# EAGLE design main (EAGLE 5.11)
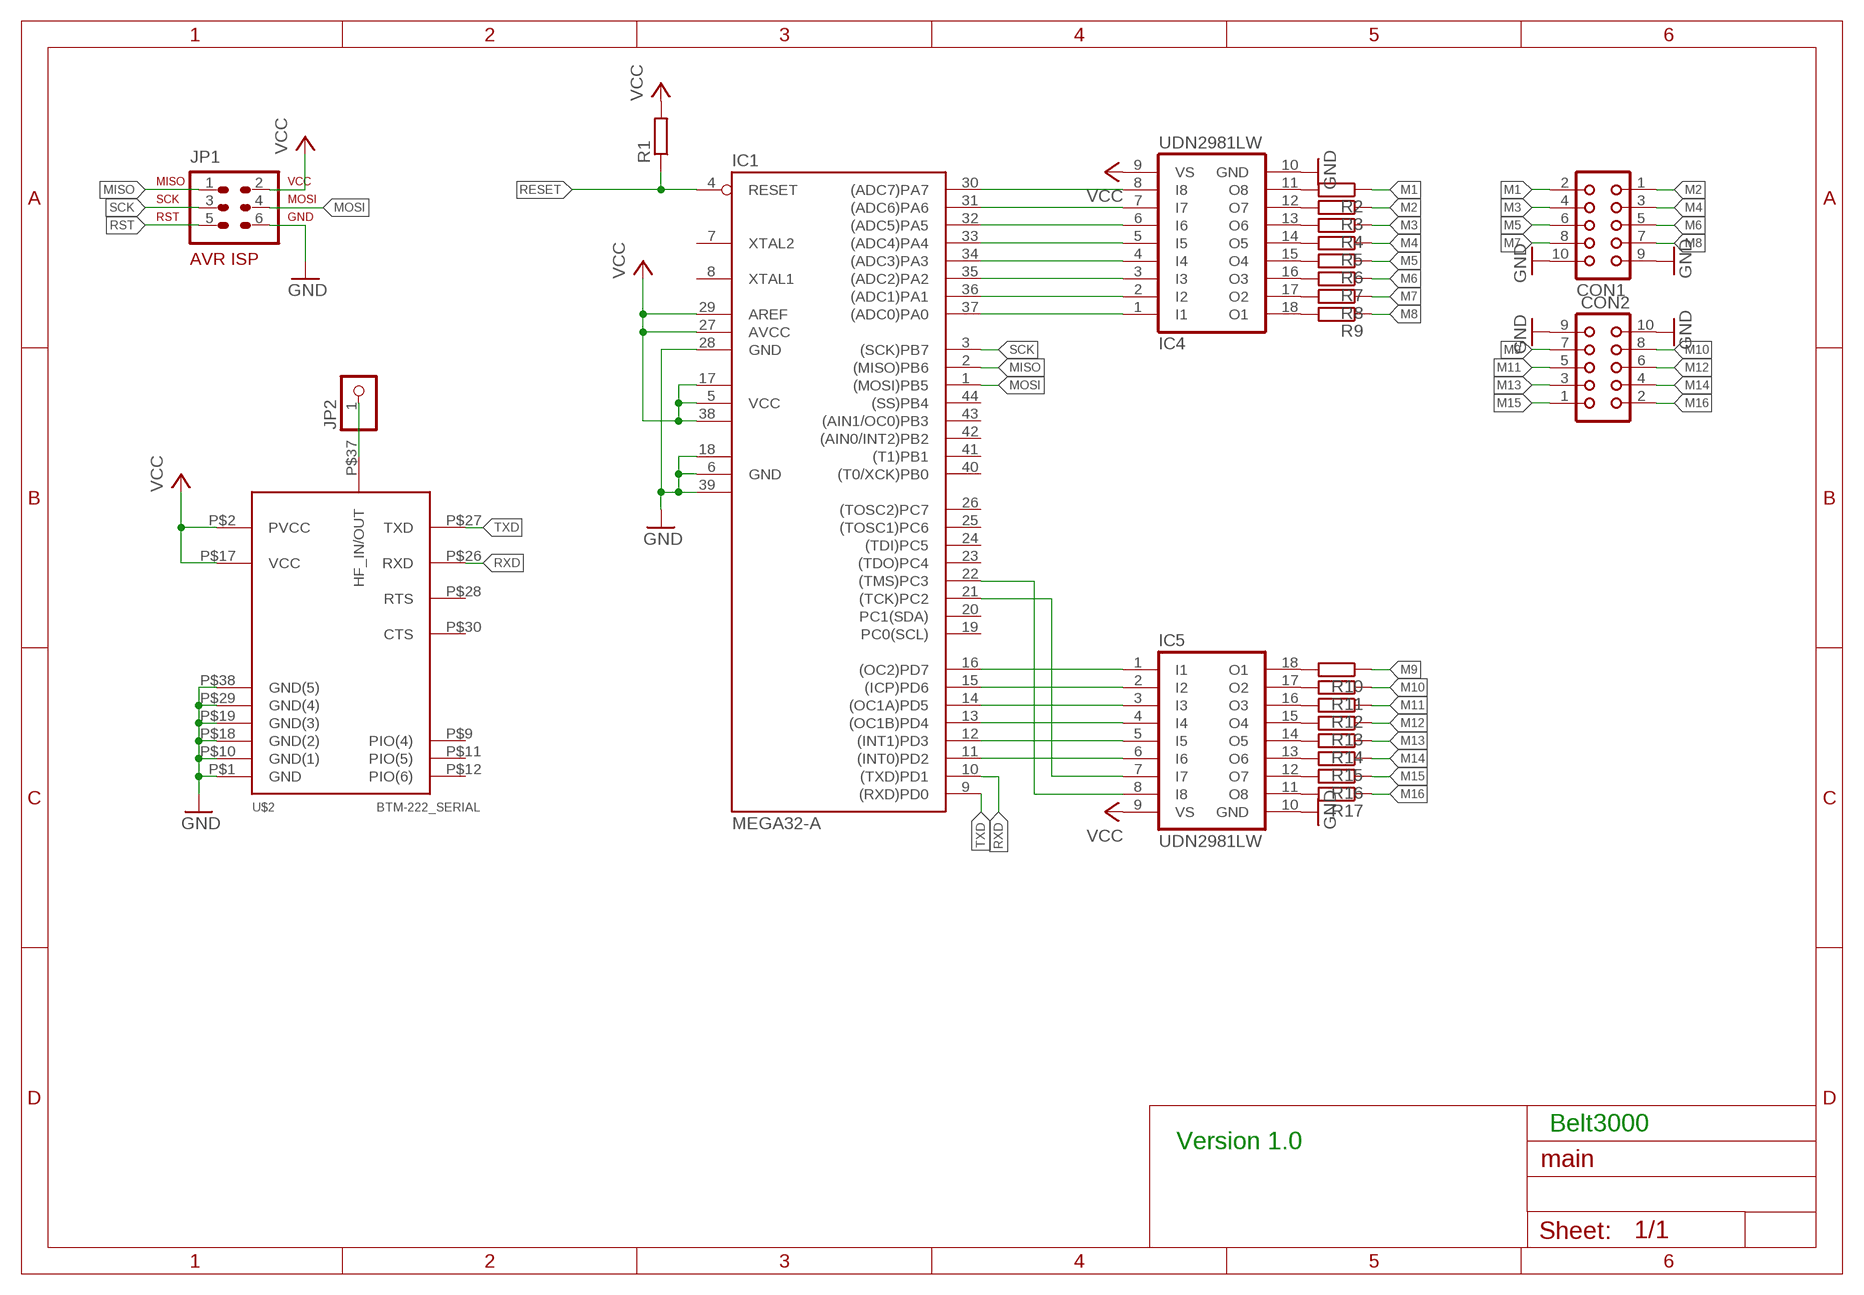
[diagram p0: schematic, sheet 1]

## Parts
CON1  CON10  [CON10]
CON2  CON10  [CON10]
IC1  MEGA32-A  [TQFP44]
IC4  UDN2981LW  [SO18W]
IC5  UDN2981LW  [SO18W]
JP1  AVR-ISP-6VERT  [AVR-ISP-6]
JP2  PINHD-1X1  [1X01]
R1  R-EU_R1206W  [R1206W]
R2  R-EU_R1206W  [R1206W]
R3  R-EU_R1206W  [R1206W]
R4  R-EU_R1206W  [R1206W]
R5  R-EU_R1206W  [R1206W]
R6  R-EU_R1206W  [R1206W]
R7  R-EU_R1206W  [R1206W]
R8  R-EU_R1206W  [R1206W]
R9  R-EU_R1206W  [R1206W]
R10  R-EU_R1206W  [R1206W]
R11  R-EU_R1206W  [R1206W]
R12  R-EU_R1206W  [R1206W]
R13  R-EU_R1206W  [R1206W]
R14  R-EU_R1206W  [R1206W]
R15  R-EU_R1206W  [R1206W]
R16  R-EU_R1206W  [R1206W]
R17  R-EU_R1206W  [R1206W]
U$2  BTM-222_SERIAL  [BTM-222]

## Nets
GND: CON1.9 CON1.10 CON2.9 CON2.10 IC1.6(GND) IC1.18(GND1) IC1.28(GND) IC1.39(GND2) IC4.10(GND) IC5.10(GND) JP1.6 U$2.P$1(GND) U$2.P$10(GND(1)) U$2.P$18(GND(2)) U$2.P$19(GND(3)) U$2.P$29(GND(4)) U$2.P$38(GND(5))
M1: CON1.2 R2.1
M2: CON1.1 R3.1
M3: CON1.4 R4.1
M4: CON1.3 R5.1
M5: CON1.6 R6.1
M6: CON1.5 R7.1
M7: CON1.8 R8.1
M8: CON1.7 R9.1
M9: CON2.7 R10.1
M10: CON2.8 R11.1
M11: CON2.5 R12.1
M12: CON2.6 R13.1
M13: CON2.3 R14.1
M14: CON2.4 R15.1
M15: CON2.1 R16.1
M16: CON2.2 R17.1
MISO: IC1.2((MISO)PB6) JP1.1
MOSI: IC1.1((MOSI)PB5) JP1.4
N$1: IC1.37((ADC0)PA0) IC4.1(I1)
N$2: IC1.36((ADC1)PA1) IC4.2(I2)
N$3: IC1.35((ADC2)PA2) IC4.3(I3)
N$4: IC1.34((ADC3)PA3) IC4.4(I4)
N$5: IC1.33((ADC4)PA4) IC4.5(I5)
N$6: IC1.32((ADC5)PA5) IC4.6(I6)
N$7: IC1.31((ADC6)PA6) IC4.7(I7)
N$8: IC1.30((ADC7)PA7) IC4.8(I8)
N$9: IC1.16((OC2)PD7) IC5.1(I1)
N$10: IC1.15((ICP)PD6) IC5.2(I2)
N$11: IC1.14((OC1A)PD5) IC5.3(I3)
N$12: IC1.13((OC1B)PD4) IC5.4(I4)
N$13: IC1.12((INT1)PD3) IC5.5(I5)
N$14: IC1.11((INT0)PD2) IC5.6(I6)
N$15: IC1.22((TMS)PC3) IC5.8(I8)
N$16: IC1.21((TCK)PC2) IC5.7(I7)
N$17: JP2.1 U$2.P$37(HF_IN/OUT)
N$18: IC4.11(O8) R2.2
N$19: IC4.12(O7) R3.2
N$20: IC4.13(O6) R4.2
N$21: IC4.14(O5) R5.2
N$22: IC4.15(O4) R6.2
N$23: IC4.16(O3) R7.2
N$24: IC4.17(O2) R8.2
N$25: IC4.18(O1) R9.2
N$26: IC5.18(O1) R10.2
N$27: IC5.17(O2) R11.2
N$28: IC5.16(O3) R12.2
N$29: IC5.15(O4) R13.2
N$30: IC5.14(O5) R14.2
N$31: IC5.13(O6) R15.2
N$32: IC5.12(O7) R16.2
N$33: IC5.11(O8) R17.2
RESET: IC1.4(RESET) R1.1
RST: JP1.5
RXD: IC1.10((TXD)PD1) U$2.P$26(RXD)
SCK: IC1.3((SCK)PB7) JP1.3
TXD: IC1.9((RXD)PD0) U$2.P$27(TXD)
VCC: IC1.5(VCC) IC1.17(VCC1) IC1.27(AVCC) IC1.29(AREF) IC1.38(VCC2) IC4.9(VS) IC5.9(VS) JP1.2 R1.2 U$2.P$2(PVCC) U$2.P$17(VCC)
Unconnected: IC1.7(XTAL2) IC1.8(XTAL1) IC1.19(PC0(SCL)) IC1.20(PC1(SDA)) IC1.23((TDO)PC4) IC1.24((TDI)PC5) IC1.25((TOSC1)PC6) IC1.26((TOSC2)PC7) IC1.40((T0/XCK)PB0) IC1.41((T1)PB1) IC1.42((AIN0/INT2)PB2) IC1.43((AIN1/OC0)PB3) IC1.44((SS)PB4) U$2.P$9(PIO(4)) U$2.P$11(PIO(5)) U$2.P$12(PIO(6)) U$2.P$28(RTS) U$2.P$30(CTS)

## Notes on the sheet
- Belt3000
- Version 1.0

## Library data of the parts
CON1 CON2 = con-harting:CON10: CONNECTOR; OC_FARNELL: unknown; OC_NEWARK: unknown
IC1 = atmel:MEGA32: MICROCONTROLLER 32 Kbytes FLASH 2 Kbytes SRAM 1 Kbytes EEPROM USART 8-channel 10 bit ADC Source: www.atmel.com .. doc2503.pdf; MPN: ATMEGA32-16AU; OC_FARNELL: 9171274; OC_NEWARK: 69K6677
IC4 IC5 = uln-udn2:UDN298*: DRIVER ARRAY Source: Allegro Microsystems Inc. / UDN2981-UDN2984.pdf
JP1 = avr-7:AVR-ISP-6: AVR ISP-6 Serial Programming Header
JP2 = pinhead:PINHD-1X1: PIN HEADER
R1-R17 = rcl:R-EU_: RESISTOR, European symbol
U$2 = BTM_222:BTM-222_SERIAL

## Board
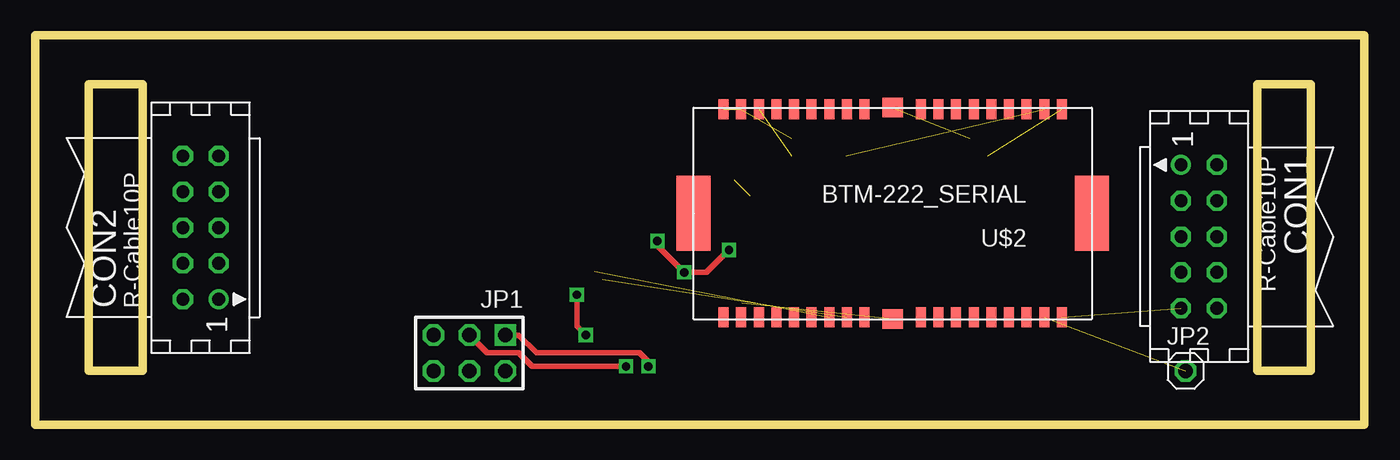
[diagram p1: board, top side]
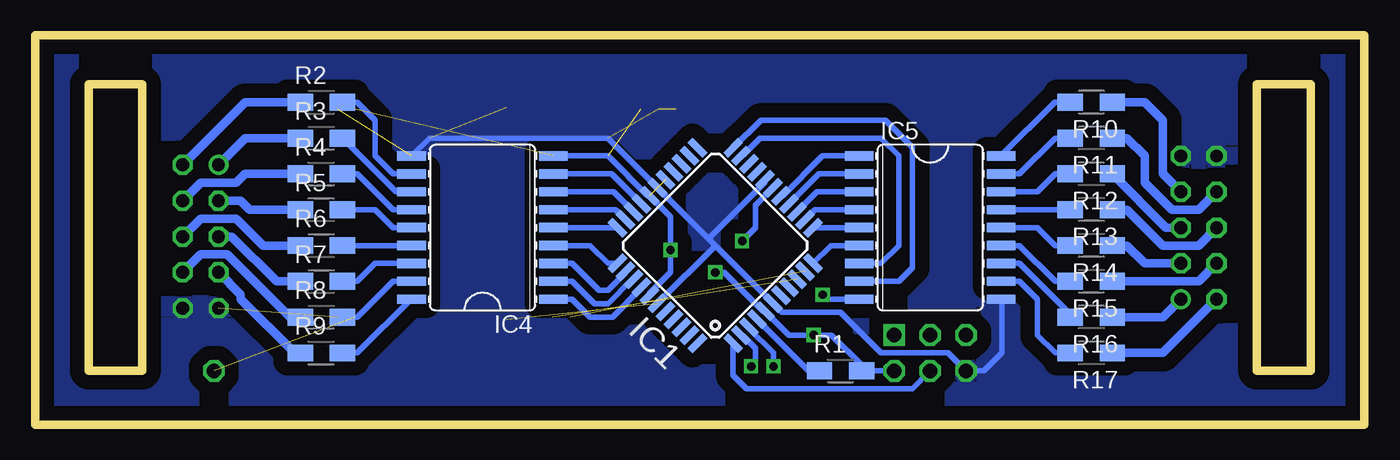
[diagram p2: board, bottom side, seen from below]

Size 94.28 x 27.61 mm. Coordinates in mm from the lower left corner, seen from the top.
Outline: 0,0 94.28,0 94.28,27.61 0,27.61 0,0
Outline: 3.81,24.13 7.62,24.13 7.62,3.81 3.81,3.81 3.81,24.13
Outline: 90.49,24.13 90.49,3.81 86.68,3.81 86.68,24.13 90.49,24.13
Copper layers (1*16): Top 0.035mm / dielectric 1.5mm / Bottom 0.035mm
Design rules "default": minimum track width 10mil, minimum drill 24mil, track to track 8mil, track to pad 8mil, pad to pad 8mil, via to via 8mil, smd to smd 8mil, copper to edge 40mil, drill to drill 8mil, minimum pad ring 10mil, minimum via ring 8mil, stop-mask expansion 4mil, vias tented up to drill 0mil, thermal gap 10mil

### Footprints (pad centres in the part's own frame; a part is rotated, then mirrored left to right if it is on the bottom)
CON10 = drill 0.914 round: 1 -5.08,-1.27 | drill 0.914 octagon: 2 -5.08,1.27; 3 -2.54,-1.27; 4 -2.54,1.27; 5 0,-1.27; 6 0,1.27; 7 2.54,-1.27; 8 2.54,1.27; 9 5.08,-1.27; 10 5.08,1.27
TQFP44 = smd 1.5 x 0.5: 1 -5.8,4; 2 -5.8,3.2; 3 -5.8,2.4; 4 -5.8,1.6; 5 -5.8,0.8; 6 -5.8,0; 7 -5.8,-0.8; 8 -5.8,-1.6; 9 -5.8,-2.4; 10 -5.8,-3.2; 11 -5.8,-4; 23 5.8,-4; 24 5.8,-3.2; 25 5.8,-2.4; 26 5.8,-1.6; 27 5.8,-0.8; 28 5.8,0; 29 5.8,0.8; 30 5.8,1.6; 31 5.8,2.4; 32 5.8,3.2; 33 5.8,4 | smd 0.5 x 1.5: 12 -4,-5.8; 13 -3.2,-5.8; 14 -2.4,-5.8; 15 -1.6,-5.8; 16 -0.8,-5.8; 17 0,-5.8; 18 0.8,-5.8; 19 1.6,-5.8; 20 2.4,-5.8; 21 3.2,-5.8; 22 4,-5.8; 34 4,5.8; 35 3.2,5.8; 36 2.4,5.8; 37 1.6,5.8; 38 0.8,5.8; 39 0,5.8; 40 -0.8,5.8; 41 -1.6,5.8; 42 -2.4,5.8; 43 -3.2,5.8; 44 -4,5.8
SO18W = smd 0.66 x 2.032: 1 -5.08,-5.029; 2 -3.81,-5.029; 3 -2.54,-5.029; 4 -1.27,-5.029; 5 0,-5.029; 6 1.27,-5.029; 7 2.54,-5.029; 8 3.81,-5.029; 9 5.08,-5.029; 10 5.08,5.029; 11 3.81,5.029; 12 2.54,5.029; 13 1.27,5.029; 14 0,5.029; 15 -1.27,5.029; 16 -2.54,5.029; 17 -3.81,5.029; 18 -5.08,5.029
AVR-ISP-6 = drill 1.016 square: 1 -2.54,-1.27 | drill 1.016 octagon: 2 -2.54,1.27; 3 0,-1.27; 4 0,1.27; 5 2.54,-1.27; 6 2.54,1.27
1X01 = drill 1.016 octagon: 1 0,0
R1206W = smd 1.8 x 1.2: 1 -1.499,0; 2 1.499,0
BTM-222 = smd 2.4 x 5.3: $AGND -14.625,3.75; $BGND 13.625,3.75 | smd 0.711 x 1.422: P$1 -12.5,-3.625; P$2 -11.25,-3.625; P$3 -10,-3.625; P$4 -8.75,-3.625; P$5 -7.5,-3.625; P$6 -6.25,-3.625; P$7 -5,-3.625; P$8 -3.75,-3.625; P$9 -2.5,-3.625; P$11 1.5,-3.625; P$12 2.75,-3.625; P$13 4,-3.625; P$14 5.25,-3.625; P$15 6.5,-3.625; P$16 7.75,-3.625; P$17 9,-3.625; P$18 10.25,-3.625; P$19 11.5,-3.625; P$20 11.5,11.125; P$21 10.25,11.125; P$22 9,11.125; P$23 7.75,11.125; P$24 6.5,11.125; P$25 5.25,11.125; P$26 4,11.125; P$27 2.75,11.125; P$28 1.5,11.125; P$30 -2.5,11.125; P$31 -3.75,11.125; P$32 -5,11.125; P$33 -6.25,11.125; P$34 -7.5,11.125; P$35 -8.75,11.125; P$36 -10,11.125; P$37 -11.25,11.125; P$38 -12.5,11.125 | smd 1.422 x 1.4: P$10 -0.5,-3.75; P$29 -0.5,11.25

### Placement (x,y rotation side)
CON1  82.55,13.33 270 top
CON2  11.75,13.97 90 top
IC1  46.04,12.7 135 bottom
IC4  62.55,13.97 90 bottom
IC5  30.8,13.97 270 bottom
JP1  30.8,5.08 180 top
JP2  81.6,3.81 0 top
R1  37.15,3.81 0 bottom
R2  73.98,22.86 0 bottom
R3  73.98,20.32 0 bottom
R4  73.98,17.78 0 bottom
R5  73.98,15.24 0 bottom
R6  73.98,12.7 0 bottom
R7  73.98,10.16 0 bottom
R8  73.98,7.62 0 bottom
R9  73.98,5.08 0 bottom
R10  19.37,22.86 180 bottom
R11  19.37,20.32 180 bottom
R12  19.37,17.78 180 bottom
R13  19.37,15.24 180 bottom
R14  19.37,12.7 180 bottom
R15  19.37,10.16 180 bottom
R16  19.37,7.62 180 bottom
R17  19.37,5.08 180 bottom
U$2  60.33,18.73 180 top

### Tracks (layer width: path | path; a pad name or v marks a point on that pad's centre or on a via)
GND  (6 unrouted)
  Bottom 0.406: IC5.10 25.72,8.84 25.72,5.08 26.99,3.81 JP1.6 29.53,5.08 34.29,5.08 37.17,7.96 41.3,7.96 IC1.6 46.04,12.7 | IC1.28 | IC1.28 53.66,20.32 66.31,20.32 IC4.10 | 46.04,12.7 46.51,13.18 | 46.51,13.18 IC1.28 | IC1.18 42.5,17.19 46.51,13.18 | IC1.39 | 46.04,12.7 IC1.39
  pour Bottom (isolate 1.016): 0.32,27.94 94.3,27.94 94.3,0 0.32,0
M1
  Bottom 0.61: R2.1 79.37,22.86 CON1.2
M2
  Bottom 0.61: R3.1 79.37,20.32 CON1.1
M3
  Bottom 0.61: R4.1 79.37,17.78 80.01,17.14 82.55,17.14 CON1.4
M4
  Bottom 0.61: R5.1 79.06,15.24 79.69,15.87 CON1.3
M5
  Bottom 0.61: R6.1 78.11,12.7 80.01,14.6 82.55,14.6 CON1.6
M6
  Bottom 0.61: R7.1 77.15,10.16 80.33,13.33 CON1.5
M7
  Bottom 0.61: R8.1 76.2,7.62 80.64,12.06 82.55,12.06 CON1.8
M8
  Bottom 0.61: R9.1 75.88,5.08 79.69,8.89 79.69,9.21 CON1.7
M9
  Bottom 0.61: R10.1 15.56,22.86 14.29,21.59 14.29,17.78 CON2.7
M10
  Bottom 0.61: R11.1 16.83,20.32 15.56,19.05 15.56,17.14 13.65,15.24 11.75,15.24 CON2.8
M11
  Bottom 0.61: CON2.5 14.06,13.97 R12.1
M12
  Bottom 0.61: R13.1 16.83,15.24 14.29,12.7 11.75,12.7 CON2.6
M13
  Bottom 0.61: R14.1 16.83,12.7 15.56,11.43 CON2.3
M14
  Bottom 0.61: R15.1 11.75,10.16 CON2.4
M15
  Bottom 0.61: R16.1 14.29,7.62 CON2.1
M16
  Bottom 0.61: R17.1 14.29,5.08 CON2.2
MISO  (via drill 0.6)
  Top 0.406: v43.5,4.13 43.5,4.44 42.86,5.08 35.56,5.08 34.29,6.35 JP1.1
  Bottom 0.406: 44.12,6.34 IC1.2 | 44.12,6.34 44.13,6.35 | 44.12,6.34 43.18,5.4 43.18,4.44 v43.5,4.13
MOSI
  Bottom 0.406: JP1.4 32.07,2.54 43.82,2.54 44.77,3.49 IC1.1
N$1
  Bottom 0.406: IC1.37 51.27,9.69 53.34,7.62 54.93,7.62 56.2,8.89 IC4.1
N$2
  Bottom 0.406: IC1.36 51.93,10.3 53.66,8.57 54.61,8.57 56.2,10.16 IC4.2
N$3
  Bottom 0.406: IC1.35 52.4,10.78 53.66,9.53 54.29,9.53 56.2,11.43 IC4.3
N$4
  Bottom 0.406: IC1.34 53.65,11.43 54.93,12.7 IC4.4
N$5
  Bottom 0.406: IC4.5 IC1.33
N$6
  Bottom 0.406: IC4.6 53.1,15.24 IC1.32
N$7
  Bottom 0.406: IC4.7 53.24,16.51 IC1.31
N$8
  Bottom 0.406: IC4.8 53.38,17.78 IC1.30
N$9
  Bottom 0.406: IC1.16 41.23,16.24 38.42,19.05 IC5.1
N$10
  Bottom 0.406: IC5.2 38.69,17.78 IC1.15
N$11
  Bottom 0.406: IC5.3 38.83,16.51 IC1.14
N$12
  Bottom 0.406: IC5.4 38.97,15.24 IC1.13
N$13
  Bottom 0.406: IC5.5 IC1.12
N$14
  Bottom 0.406: IC5.6 37.84,12.7 IC1.11
N$15
  Bottom 0.406: IC5.8 33.02,10.16 32.07,11.11 32.07,19.69 33.97,21.59 42.8,21.59 IC1.22
N$16
  Bottom 0.406: IC1.21 44.12,19.06 42.86,20.32 34.29,20.32 33.02,19.05 33.02,12.7 34.29,11.43 IC5.7
N$17  (1 unrouted)
N$18
  Bottom 0.406: IC4.11 68.9,17.78 70.17,19.05 70.17,21.59 71.44,22.86 R2.2
N$19
  Bottom 0.406: IC4.12 68.67,16.51 R3.2
N$20
  Bottom 0.406: IC4.13 68.9,15.24 71.44,17.78 R4.2
N$21
  Bottom 0.406: R5.2 70.17,15.24 68.9,13.97 IC4.14
N$22
  Bottom 0.406: IC4.15 R6.2
N$23
  Bottom 0.406: IC4.16 70.17,11.43 71.44,10.16 R7.2
N$24
  Bottom 0.406: IC4.17 68.9,10.16 71.44,7.62 R8.2
N$25
  Bottom 0.406: IC4.18 67.63,8.89 71.44,5.08 R9.2
N$26
  Bottom 0.406: R10.2 21.96,22.86 IC5.18
N$27
  Bottom 0.406: R11.2 21.91,20.32 24.45,17.78 IC5.17
N$28
  Bottom 0.406: R12.2 21.91,17.78 23.18,16.51 IC5.16
N$29
  Bottom 0.406: R13.2 IC5.15
N$30
  Bottom 0.406: R14.2 21.91,12.7 23.18,13.97 IC5.14
N$31
  Bottom 0.406: R15.2 21.91,10.16 24.45,12.7 IC5.13
N$32
  Bottom 0.406: R16.2 20.87,7.85 24.45,11.43 IC5.12
N$33
  Bottom 0.406: R17.2 21.91,5.08 23.18,6.35 23.18,8.89 24.45,10.16 IC5.11
RESET
  Bottom 0.406: R1.1 39.41,3.81 IC1.4
RXD  (1 unrouted)
SCK  (via drill 0.6)
  Top 0.406: v41.91,4.13 35.24,4.13 34.29,5.08 32.07,5.08 JP1.3
  Bottom 0.406: IC1.3 43.63,6.8 41.91,5.08 v41.91,4.13
TXD  (1 unrouted)
VCC  (via drill 0.6)  (3 unrouted)
  Top 0.406: v38.42,9.21 38.42,6.98 v39.05,6.35 | v49.21,12.38 47.62,10.79 v46.04,10.79 44.13,12.7 v44.13,13.02
  Bottom 0.406: IC4.9 53.66,19.05 50.84,16.24 IC1.29 49.21,14.74 v49.21,12.38 49.21,10.79 50.7,9.3 IC1.38 | JP1.2 R1.2 35.65,4.22 37.78,6.35 v39.05,6.35 40.82,6.35 IC1.5 42.64,8.03 45.4,10.79 v46.04,10.79 | IC5.9 38.1,8.89 v38.42,9.21 | IC1.17 43.18,15.56 43.18,13.97 v44.13,13.02